# Altium schematic sheet P_DP_REFCLK_SFP.SchDoc
size 420 x 297 mm; Author: ALTIUM GOSTBOM2.0 KEV; SheetNumber: 20; SheetTotal: 48
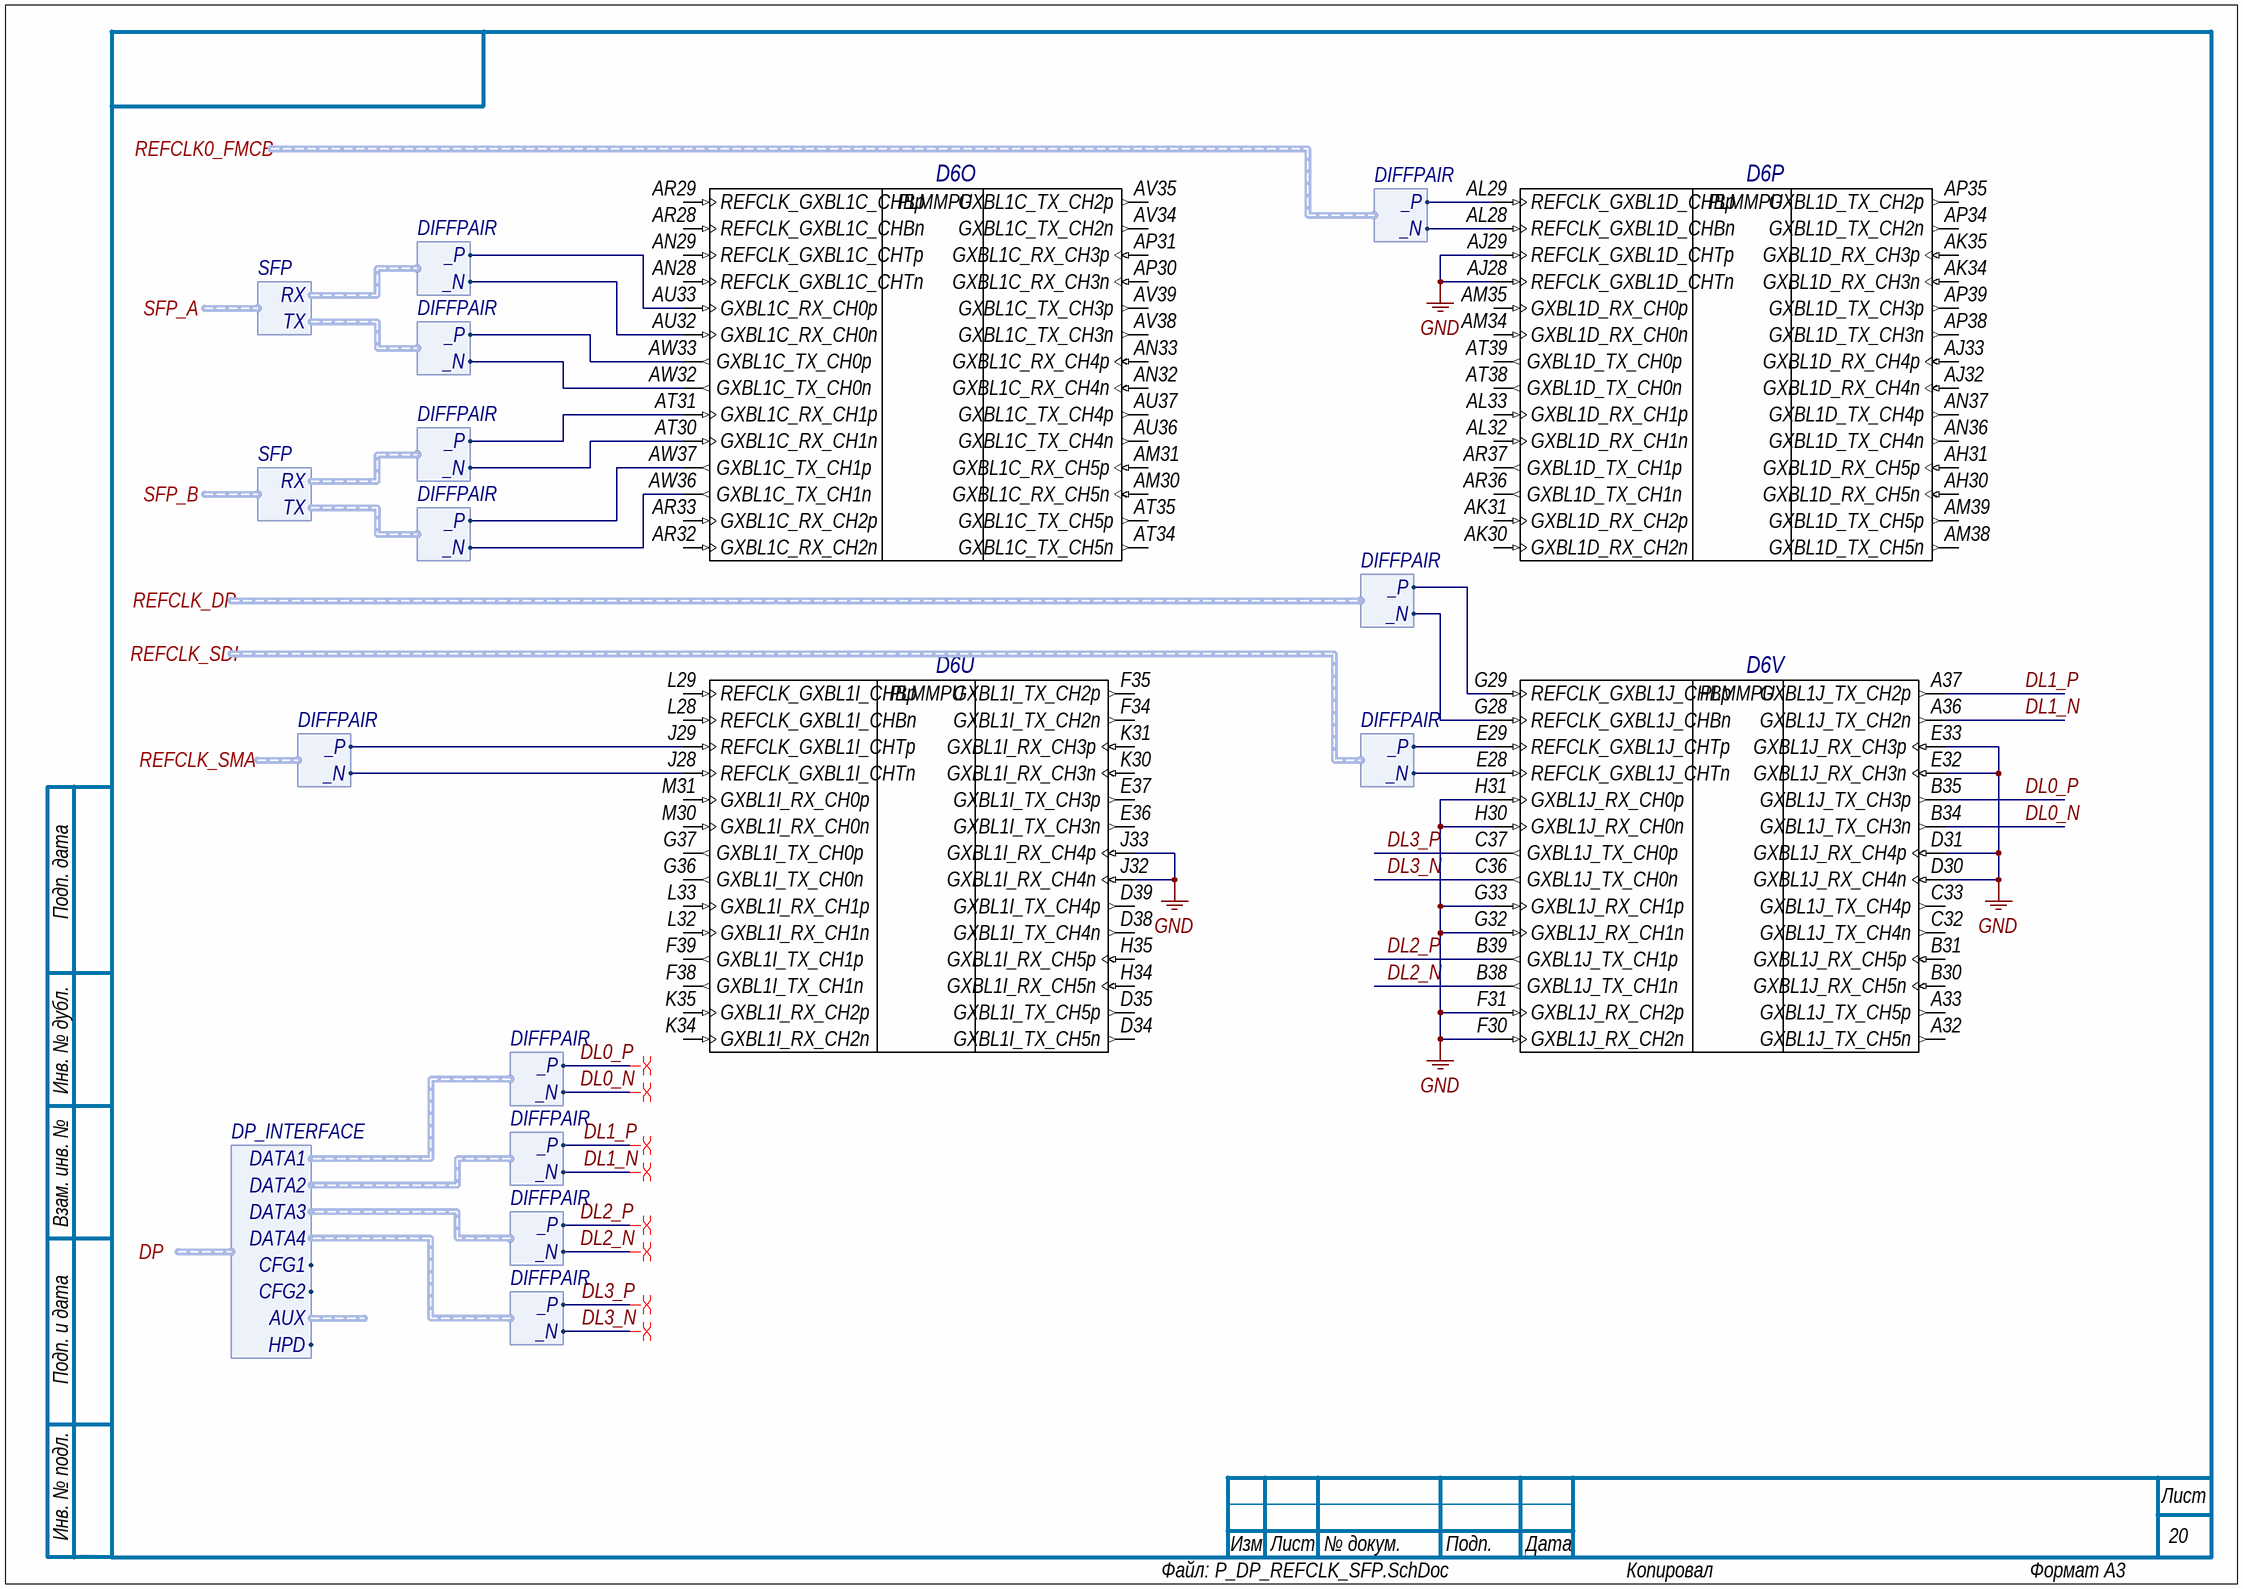
[diagram p0: P_DP_REFCLK_SFP.SchDoc]

## Parts
D6  10AS066N3F40E2SGE2  [ALTR-FBGA1517_A-350]  (value not drawn)  (parts O,P,U,V of 39)

## Ports
DP (harness DP_INTERFACE), REFCLK0_FMCB (harness DIFFPAIR), REFCLK_DP (harness DIFFPAIR), REFCLK_SDI (harness DIFFPAIR), REFCLK_SMA (harness DIFFPAIR), SFP_A (harness SFP), SFP_B (harness SFP)

## Harnesses
SFP: RX, TX
DIFFPAIR: _P, _N
DP_INTERFACE: DATA1, DATA2, DATA3, DATA4, CFG1, CFG2, AUX, HPD

## Nets
GND: D6.AJ28(REFCLK_GXBL1D_CHTn) D6.AJ29(REFCLK_GXBL1D_CHTp) D6.D30(GXBL1J_RX_CH4n) D6.D31(GXBL1J_RX_CH4p) D6.E32(GXBL1J_RX_CH3n) D6.E33(GXBL1J_RX_CH3p) D6.F30(GXBL1J_RX_CH2n) D6.F31(GXBL1J_RX_CH2p) D6.G32(GXBL1J_RX_CH1n) D6.G33(GXBL1J_RX_CH1p) D6.H30(GXBL1J_RX_CH0n) D6.H31(GXBL1J_RX_CH0p) D6.J32(GXBL1I_RX_CH4n) D6.J33(GXBL1I_RX_CH4p)
DL0_N: D6.B34(GXBL1J_TX_CH3n) ; harness DIFFPAIR._N
DL0_P: D6.B35(GXBL1J_TX_CH3p) ; harness DIFFPAIR._P
DL1_N: D6.A36(GXBL1J_TX_CH2n) ; harness DIFFPAIR._N
DL1_P: D6.A37(GXBL1J_TX_CH2p) ; harness DIFFPAIR._P
DL2_N: D6.B38(GXBL1J_TX_CH1n) ; harness DIFFPAIR._N
DL2_P: D6.B39(GXBL1J_TX_CH1p) ; harness DIFFPAIR._P
DL3_N: D6.C36(GXBL1J_TX_CH0n) ; harness DIFFPAIR._N
DL3_P: D6.C37(GXBL1J_TX_CH0p) ; harness DIFFPAIR._P
NetD6_AL28: D6.AL28(REFCLK_GXBL1D_CHBn) ; port REFCLK0_FMCB._N
NetD6_AL29: D6.AL29(REFCLK_GXBL1D_CHBp) ; port REFCLK0_FMCB._P
NetD6_AT30: D6.AT30(GXBL1C_RX_CH1n) ; harness DIFFPAIR._N
NetD6_AT31: D6.AT31(GXBL1C_RX_CH1p) ; harness DIFFPAIR._P
NetD6_AU32: D6.AU32(GXBL1C_RX_CH0n) ; harness DIFFPAIR._N
NetD6_AU33: D6.AU33(GXBL1C_RX_CH0p) ; harness DIFFPAIR._P
NetD6_AW32: D6.AW32(GXBL1C_TX_CH0n) ; harness DIFFPAIR._N
NetD6_AW33: D6.AW33(GXBL1C_TX_CH0p) ; harness DIFFPAIR._P
NetD6_AW36: D6.AW36(GXBL1C_TX_CH1n) ; harness DIFFPAIR._N
NetD6_AW37: D6.AW37(GXBL1C_TX_CH1p) ; harness DIFFPAIR._P
NetD6_E28: D6.E28(REFCLK_GXBL1J_CHTn) ; port REFCLK_SDI._N
NetD6_E29: D6.E29(REFCLK_GXBL1J_CHTp) ; port REFCLK_SDI._P
NetD6_G28: D6.G28(REFCLK_GXBL1J_CHBn) ; port REFCLK_DP._N
NetD6_G29: D6.G29(REFCLK_GXBL1J_CHBp) ; port REFCLK_DP._P
NetD6_J28: D6.J28(REFCLK_GXBL1I_CHTn) ; port REFCLK_SMA._N
NetD6_J29: D6.J29(REFCLK_GXBL1I_CHTp) ; port REFCLK_SMA._P

Not connected (* = marked no-connect by the designer): D6 A32(GXBL1J_TX_CH5n) A33(GXBL1J_TX_CH5p) AH30(GXBL1D_RX_CH5n) AH31(GXBL1D_RX_CH5p) AJ32(GXBL1D_RX_CH4n) AJ33(GXBL1D_RX_CH4p) AK30(GXBL1D_RX_CH2n) AK31(GXBL1D_RX_CH2p) AK34(GXBL1D_RX_CH3n) AK35(GXBL1D_RX_CH3p) AL32(GXBL1D_RX_CH1n) AL33(GXBL1D_RX_CH1p) AM30(GXBL1C_RX_CH5n) AM31(GXBL1C_RX_CH5p) AM34(GXBL1D_RX_CH0n) AM35(GXBL1D_RX_CH0p) AM38(GXBL1D_TX_CH5n) AM39(GXBL1D_TX_CH5p) AN28(REFCLK_GXBL1C_CHTn) AN29(REFCLK_GXBL1C_CHTp) AN32(GXBL1C_RX_CH4n) AN33(GXBL1C_RX_CH4p) AN36(GXBL1D_TX_CH4n) AN37(GXBL1D_TX_CH4p) AP30(GXBL1C_RX_CH3n) AP31(GXBL1C_RX_CH3p) AP34(GXBL1D_TX_CH2n) AP35(GXBL1D_TX_CH2p) AP38(GXBL1D_TX_CH3n) AP39(GXBL1D_TX_CH3p) AR28(REFCLK_GXBL1C_CHBn) AR29(REFCLK_GXBL1C_CHBp) AR32(GXBL1C_RX_CH2n) AR33(GXBL1C_RX_CH2p) AR36(GXBL1D_TX_CH1n) AR37(GXBL1D_TX_CH1p) AT34(GXBL1C_TX_CH5n) AT35(GXBL1C_TX_CH5p) AT38(GXBL1D_TX_CH0n) AT39(GXBL1D_TX_CH0p) AU36(GXBL1C_TX_CH4n) AU37(GXBL1C_TX_CH4p) AV34(GXBL1C_TX_CH2n) AV35(GXBL1C_TX_CH2p) AV38(GXBL1C_TX_CH3n) AV39(GXBL1C_TX_CH3p) B30(GXBL1J_RX_CH5n) B31(GXBL1J_RX_CH5p) C32(GXBL1J_TX_CH4n) C33(GXBL1J_TX_CH4p) D34(GXBL1I_TX_CH5n) D35(GXBL1I_TX_CH5p) D38(GXBL1I_TX_CH4n) D39(GXBL1I_TX_CH4p) E36(GXBL1I_TX_CH3n) E37(GXBL1I_TX_CH3p) F34(GXBL1I_TX_CH2n) F35(GXBL1I_TX_CH2p) F38(GXBL1I_TX_CH1n) F39(GXBL1I_TX_CH1p) G36(GXBL1I_TX_CH0n) G37(GXBL1I_TX_CH0p) H34(GXBL1I_RX_CH5n) H35(GXBL1I_RX_CH5p) K30(GXBL1I_RX_CH3n) K31(GXBL1I_RX_CH3p) K34(GXBL1I_RX_CH2n) K35(GXBL1I_RX_CH2p) L28(REFCLK_GXBL1I_CHBn) L29(REFCLK_GXBL1I_CHBp) L32(GXBL1I_RX_CH1n) L33(GXBL1I_RX_CH1p) M30(GXBL1I_RX_CH0n) M31(GXBL1I_RX_CH0p)

## Layout directives
differential pair: DL0_N, DL0_P, DL1_N, DL1_P, DL2_N, DL2_P, DL3_N, DL3_P

## Notes on the sheet
- Подп. дата
- Инв. № дубл.
- Взам. инв. №
- Подп. и дата
- Инв. № подл.
- Изм.
- Лист
- № докум.
- Подп.
- Дата
- ALTIUM GOSTBOM2.0 KEV
- Файл:
- Копировал
- Формат А3
- (in symbol E105, part O) PLMMPU
- (in symbol E105, part P) PLMMPU
- (in symbol E105, part U) PLMMPU
- (in symbol E105, part V) PLMMPU

## Library data of the parts
D6 = E105: Arria 10 SX Family, 588 I/O Pins, 16 Fractional PLLs, 1517-Pin FBGA, Speed Grade 2, Extended Grade, RoHS; Тип элемента: ПЛИС; Old_des: U1; New_des: D6; UID: E105; Component Kind: Standard; ComponentLink1Description: Manufacturer URL; ComponentLink1URL: https://www.altera.com/; ComponentLink2Description: Datasheet; ComponentLink2URL: https://www.altera.com/content/dam/altera-www/global/en_US/pdfs/literature/hb/arria-10/a10_datasheet.pdf; DatasheetVersion: Rev. 2016-06-24, 06/2016; Mounting Technology: Surface Mount; PackageDescription: 1517-Pin FineLine Ball-Grid Array (FBGA), Body 40 x 40 mm, Pitch 1 mm; PartNumber: 10AS066N3F40E2SGE2; Code_JEDEC: MS-034; ComponentLink3Description: Package Specification; ComponentLink3URL: https://www.altera.com/content/dam/altera-www/global/en_US/pdfs/literature/packaging/04r00461-04.pdf; PackageVersion: Rev. 5.0, 01/2016